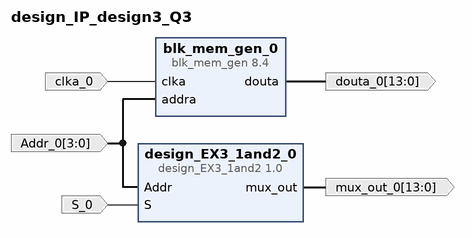
[diagram p0: block diagram of the top level]
# Vivado block design design_IP_design3_Q3, xc7a35tcpg236-1, Vivado 2023.2
create_bd_design design_IP_design3_Q3

create_bd_port -dir I -from 3 -to 0 Addr_0
create_bd_port -dir I S_0
create_bd_port -dir O -from 13 -to 0 mux_out_0
create_bd_port -dir I -type clk clka_0
create_bd_port -dir O -from 13 -to 0 douta_0

create_bd_cell -type ip -vlnv xilinx.com:ip:blk_mem_gen:8.4 blk_mem_gen_0
set_property -dict [list \
  CONFIG.Coe_File ../../../../../../../design_EX3_1and2/design_IP_design3_Q3_blk_mem_gen_0_0.coe \
  CONFIG.Enable_A Always_Enabled \
  CONFIG.Fill_Remaining_Memory_Locations true \
  CONFIG.Load_Init_File true \
  CONFIG.Memory_Type Single_Port_ROM \
  CONFIG.Write_Depth_A 16 \
  CONFIG.Write_Width_A 14 \
  CONFIG.use_bram_block Stand_Alone \
] [get_bd_cells blk_mem_gen_0]
create_bd_cell -type ip -vlnv xilinx.com:user:design_EX3_1and2:1.0 design_EX3_1and2_0

# ---- connections ----

connect_bd_net -net Addr_0_1 [get_bd_ports Addr_0] [get_bd_pins design_EX3_1and2_0/Addr] [get_bd_pins blk_mem_gen_0/addra]
connect_bd_net -net S_0_1 [get_bd_ports S_0] [get_bd_pins design_EX3_1and2_0/S]
connect_bd_net [get_bd_pins blk_mem_gen_0/douta] [get_bd_ports douta_0]
connect_bd_net -net clka_0_1 [get_bd_ports clka_0] [get_bd_pins blk_mem_gen_0/clka]
connect_bd_net [get_bd_pins design_EX3_1and2_0/mux_out] [get_bd_ports mux_out_0]

validate_bd_design
save_bd_design
